# Altium schematic sheet Sheet1.SchDoc
size 304 x 190 mm; SheetNumber: 1; SheetTotal: 2
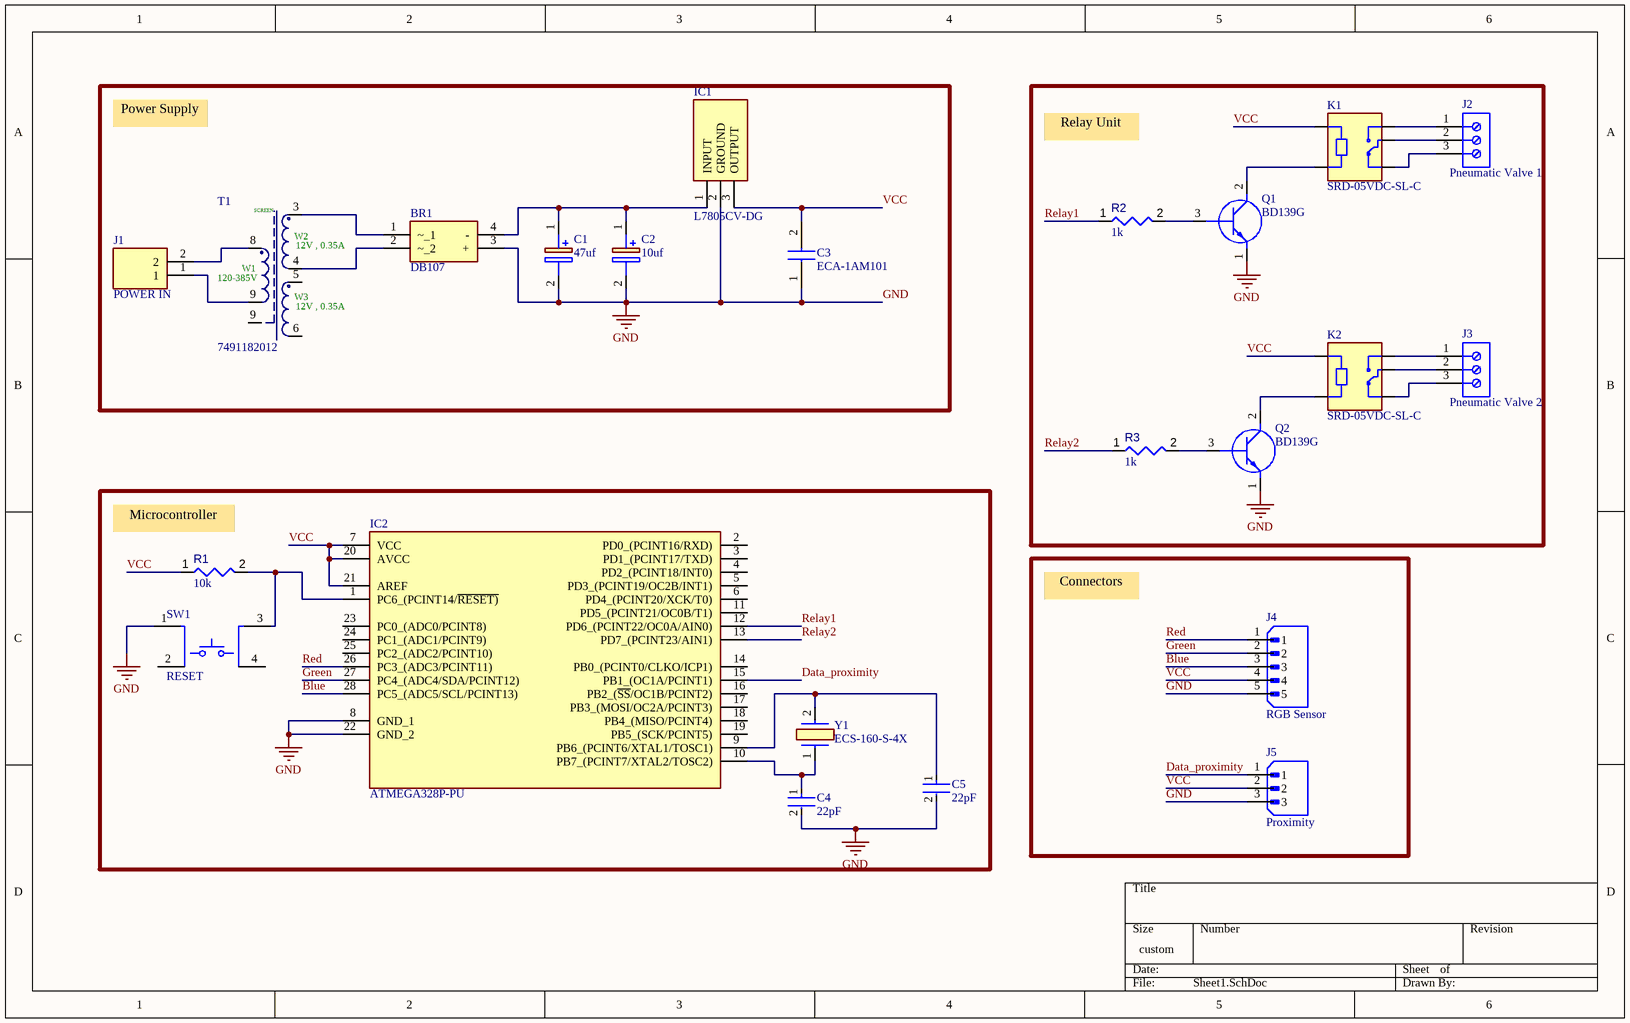
[diagram p0: Sheet1.SchDoc]

## Parts
BR1  DB107  [DIP825W50P510L830H340Q4N]
C1  47uf  [CAPPRD250W55D630H1220]
C2  10uf  [CAPPRD200W55D500H1200]
C3  ECA-1AM101  [CAPPRD200W55D525H1200]
C4  22pF  [FP-RCE0DB-MFG]
C5  22pF  [FP-RCE0DB-MFG]
IC1  L7805CV-DG  [TO255P460X1020X2008-3P]
IC2  ATMEGA328P-PU  [DIP794W53P254L3467H457Q28N]
J1  POWER IN  [TB00250002BE]
J2  Pneumatic Valve 1  [691101710003]
J3  Pneumatic Valve 2  [691101710003]
J4  RGB Sensor  [JST_B5B-XH-A(LF)(SN)]
J5  Proximity  [JST_B3B-XH-A (LF)(SN)]
K1  SRD-05VDC-SL-C  [RELAY_SRD-05VDC-SL-C]
K2  SRD-05VDC-SL-C  [RELAY_SRD-05VDC-SL-C]
Q1  BD139G  [TO229P300X760X1364-3P]
Q2  BD139G  [TO229P300X760X1364-3P]
R1  value 10k  [RESA60-630X240]  (hidden comment: MFR-25FBF52-10K)
R2  value 1k  [RESA60-630X240]  (hidden comment: MFR-25FBF52-1K)
R3  value 1k  [RESA60-630X240]  (hidden comment: MFR-25FBF52-1K)
SW1  RESET  [FP-SKQBARA010-MFG]
T1  7491182012  [EE16_7_4 (E16)]
Y1  ECS-160-S-4X  [ECS160S4X]

## Nets
GND: BR1.3(+) C1.2(-) C2.2(-) C3.1(+) C4.2 C5.2 IC1.2(GROUND) IC2.8(GND_1) IC2.22(GND_2) J4.5 J5.3 Q1.1(E) Q2.1(E) SW1.1
Blue: IC2.28(PC5_(ADC5/SCL/PCINT13)) J4.3
Data_proximity: IC2.15(PB1_(OC1A/PCINT1)) J5.1
Green: IC2.27(PC4_(ADC4/SDA/PCINT12)) J4.2
Red: IC2.26(PC3_(ADC3/PCINT11)) J4.1
Relay1: IC2.12(PD6_(PCINT22/OC0A/AIN0)) R2.1
Relay2: IC2.13(PD7_(PCINT23/AIN1)) R3.1
VCC: C3.2(-) IC1.3(OUTPUT) IC2.7(VCC) IC2.20(AVCC) IC2.21(AREF) J4.4 J5.2 K1.A1 K2.A1 R1.1
NetBR1_1: BR1.1(~_1) T1.3
NetBR1_2: BR1.2(~_2) T1.4
NetBR1_4: BR1.4(-) C1.1(+) C2.1(+) IC1.1(INPUT)
NetC4_1: C4.1 IC2.10(PB7_(PCINT7/XTAL2/TOSC2)) Y1.1
NetC5_1: C5.1 IC2.9(PB6_(PCINT6/XTAL1/TOSC1)) Y1.2
NetIC2_1: IC2.1(PC6_(PCINT14/~{RESET)}) R1.2 SW1.3
NetJ1_1: J1.1 T1.9
NetJ1_2: J1.2 T1.8
NetJ2_1: J2.1 K1.NO
NetJ2_2: J2.2 K1.COM
NetJ2_3: J2.3 K1.NC
NetJ3_1: J3.1 K2.NO
NetJ3_2: J3.2 K2.COM
NetJ3_3: J3.3 K2.NC
NetK1_A2: K1.A2 Q1.2(C)
NetK2_A2: K2.A2 Q2.2(C)
NetQ1_3: Q1.3(B) R2.2
NetQ2_3: Q2.3(B) R3.2

Not connected (* = marked no-connect by the designer): IC2 2(PD0_(PCINT16/RXD)) 3(PD1_(PCINT17/TXD)) 4(PD2_(PCINT18/INT0)) 5(PD3_(PCINT19/OC2B/INT1)) 6(PD4_(PCINT20/XCK/T0)) 11(PD5_(PCINT21/OC0B/T1)) 14(PB0_(PCINT0/CLKO/ICP1)) 16(PB2_(~{SS}/OC1B/PCINT2)) 17(PB3_(MOSI/OC2A/PCINT3)) 18(PB4_(MISO/PCINT4)) 19(PB5_(SCK/PCINT5)) 23(PC0_(ADC0/PCINT8)) 24(PC1_(ADC1/PCINT9)) 25(PC2_(ADC2/PCINT10)); SW1 2 4; T1 5 6

## Notes on the sheet
- Power Supply
- Relay Unit
- (near R1) Microcontroller
- Connectors
- (in symbol CMP-1471-00001-1) SCREEN; W2; 12V , 0.35A; W1; 120-385V; W3

## Library data of the parts
BR1 = DB107: Bridge Rectifier; Manufacturer_Name: Rectron; Datasheet Link: https://www.rectron.com/data_sheets/db101-107.pdf; Height: 3.4mm; Manufacturer_Part_Number: DB107; Mouser Part Number: 583-DB107; Mouser Price/Stock: https://www.mouser.co.uk/ProductDetail/Rectron/DB107?qs=G5AQjGfRJcLGAY%252B6bEDnbw%3D%3D
C1 = ECE-A1EN470UB: Capacitor Polarised; Manufacturer_Name: Panasonic; Datasheet Link: http://industrial.panasonic.com/cdbs/www-data/pdf/RDF0000/ABA0000C1053.pdf; Height: 12.2mm; Manufacturer_Part_Number: ECE-A1EN470UB; Mouser Part Number: 667-ECE-A1EN470UB; Mouser Price/Stock: https://www.mouser.co.uk/ProductDetail/Panasonic/ECE-A1EN470UB?qs=rMMd5vBiahp%252B1Xr0dP1Lmg%3D%3D
C2 = ECA-1EM100: Capacitor Polarised; Manufacturer_Name: Panasonic; Datasheet Link: https://componentsearchengine.com/Datasheets/2/ECA-1EM100.pdf; Height: 12mm; Manufacturer_Part_Number: ECA-1EM100; Mouser Part Number: 667-ECA-1EM100; Mouser Price/Stock: https://www.mouser.com/Search/Refine.aspx?Keyword=667-ECA-1EM100; Arrow Part Number: ECA-1EM100; Arrow Price/Stock: https://www.arrow.com/en/products/eca1em100/panasonic
C3 = ECA-1AM101: Capacitor; Manufacturer_Name: Panasonic; Datasheet Link: http://uk.rs-online.com/web/p/products/8073233; Height: 12mm; Manufacturer_Part_Number: ECA-1AM101; Mouser Part Number: 667-ECA-1AM101; Mouser Price/Stock: https://www.mouser.co.uk/ProductDetail/Panasonic/ECA-1AM101?qs=o8jAzVTWolupLSuBsMrKhQ%3D%3D; Arrow Part Number: ECA-1AM101; Arrow Price/Stock: https://www.arrow.com/en/products/eca-1am101/panasonic?region=nac
C4 C5 = CMP-06035-047347-1: Cap Ceramic 22pF 100V C0G ±5% Radial 2.5mm +125°C Ammo Pack; Lead Diameter: 0.5mm; Lead/Base Style: Straight; Height: 3.5mm; Voltage: 100V; Mount: Through Hole; Min Operating Temperature: -55°C; Height - Seated (Max): 0.138inch; Dielectric: C0G; Width: 0.098inch; Depth: 2.5mm; Lead Pitch: 0.098inch; Packaging: Tape and Reel; Voltage Rating (DC): 100V; Capacitance: 22pF; Package Quantity: 2000; Max Operating Temperature: 125°C; Tolerance: 5%; Termination: Radial; Voltage Rating: 100V; Case/Package: Radial; Resistor Type: Ceramic; Length: 3.6mm; Ratings: AEC-Q200
IC1 = L7805CV-DG: Integrated Circuit; Manufacturer_Name: STMicroelectronics; Datasheet Link: http://www.st.com/web/en/resource/technical/document/datasheet/CD00000444.pdf; Height: 4.6mm; Manufacturer_Part_Number: L7805CV-DG; Mouser Part Number: 511-L7805CV-DG; Mouser Price/Stock: https://www.mouser.co.uk/ProductDetail/STMicroelectronics/L7805CV-DG?qs=T%2FOtf55vL7c3O0as9P9fAw%3D%3D; Arrow Part Number: L7805CV-DG; Arrow Price/Stock: https://www.arrow.com/en/products/l7805cv-dg/stmicroelectronics?region=europe
IC2 = ATMEGA328P-PU: Integrated Circuit; Manufacturer_Name: Microchip; Datasheet Link: https://www.mouser.ca/datasheet/2/268/ATmega48A_PA_88A_PA_168A_PA_328_P_DS_DS40002061B-3050139.pdf; Height: 4.572mm; Manufacturer_Part_Number: ATMEGA328P-PU; Mouser Part Number: 556-ATMEGA328P-PU; Mouser Price/Stock: https://www.mouser.co.uk/ProductDetail/Microchip-Technology/ATMEGA328P-PU?qs=K8BHR703ZXguOQv3sKbWcg%3D%3D; Arrow Part Number: ATMEGA328P-PU; Arrow Price/Stock: https://www.arrow.com/en/products/atmega328p-pu/microchip-technology?region=europe
J1 = TB002-500-02BE: Connector; Manufacturer_Name: CUI Devices; Datasheet Link: https://eu.mouser.com/datasheet/2/670/tb002_500-1550579.pdf; Height: 10.4mm; Manufacturer_Part_Number: TB002-500-02BE; Mouser Part Number: 490-TB002-500-02BE; Mouser Price/Stock: https://www.mouser.co.uk/ProductDetail/CUI-Devices/TB002-500-02BE?qs=vLWxofP3U2x9716kcgva%2Fw%3D%3D; Arrow Part Number: TB002-500-02BE; Arrow Price/Stock: https://www.arrow.com/en/products/tb002-500-02be/cui-devices?region=nac
J2 J3 = CMP-1502-03257-2: NexarPartId: 8917705; Voltage Rating: 250V; Current: 16A; Wire Gauge (Min): 14AWG; Pitch: 5.0038mm; Wire Gauge (Max): 26AWG; Number of Positions Per Level: 3; Plating: Steel; Number of Levels: 1; Stripping Length: -7mm; REACH SVHC: Unknown; Width: 16.2mm; Height: 16.4mm; Contact Material: Brass; RoHS: Compliant; Color: Blue; Contact Plating: Tin; Lead Pitch: 5mm; Packaging: Box; Termination: Screw; Number of Contacts: 3; Wire/Cable Gauge: 26AWG; Min Operating Temperature: -40°C; Max Operating Temperature: 105°C; Housing Material: Nylon; Length: 9mm; Voltage: 250V; Mount: Through Hole; Current Rating: 16A; Number of Pins: 3
J4 = B5B-XH-A(LF)(SN): Connector Header Through Hole 5 position 0.098 (2.50mm); MF: JST Sales America Inc.; SnapEDA_Link: https://www.snapeda.com/parts/B5B-XH-A(LF)(SN)/JST+Sales+America+Inc./view-part/?ref=snap; Package: None; Value: *; MP: B5B-XH-A(LF)(SN); Check_prices: https://www.snapeda.com/parts/B5B-XH-A(LF)(SN)/JST+Sales+America+Inc./view-part/?ref=eda
J5 = B3B-XH-A_(LF)(SN): Connector Header Through Hole 3 position 0.098 (2.50mm); MF: JST Sales America Inc.; MP: B3B-XH-A (LF)(SN); SnapEDA_Link: https://www.snapeda.com/parts/B3B-XH-A%20(LF)(SN)/JST+Sales+America+Inc./view-part/?ref=snap; Package: None; Value: *; Check_prices: https://www.snapeda.com/parts/B3B-XH-A%20(LF)(SN)/JST+Sales+America+Inc./view-part/?ref=eda
K1 K2 = SRD-05VDC-SL-C: 5V Trigger Relay Module For Arduino And Raspberry Pi 5V Trigger Relay Module For Arduino And Raspberry Pi; MF: Songle Relay; Check_prices: https://www.snapeda.com/parts/SRD-05VDC-SL-C/Songle+Relay/view-part/?ref=eda; Value: *; Availability: Not in stock; Price: None; Package: NON STANDARD-5 Songle Relay; MP: SRD-05VDC-SL-C; SnapEDA_Link: https://www.snapeda.com/parts/SRD-05VDC-SL-C/Songle+Relay/view-part/?ref=snap
Q1 Q2 = BD139G: Transistor BJT NPN; Manufacturer_Name: onsemi; Datasheet Link: http://www.onsemi.com/pub/Collateral/BD135-D.PDF; Height: 3mm; Manufacturer_Part_Number: BD139G; Mouser Part Number: 863-BD139G; Mouser Price/Stock: https://www.mouser.co.uk/ProductDetail/onsemi/BD139G?qs=vNc2DXHODiLIqGggNMT6cg%3D%3D; Arrow Part Number: BD139G; Arrow Price/Stock: https://www.arrow.com/en/products/bd139g/on-semiconductor?region=nac
R1 = CMP-009-00047-4: Axial Resistor, 10 KOhm, +/- 1%, 0.25 W, -55 to 155 degC, 2-Pin THD, RoHS, Bulk; Manufacturer: Yageo; Power: 250mW; Voltage Rating: 250V; Manufacturer URL: http://www.yageo.com/; Datasheet URL: http://www.yageo.com/documents/recent/Yageo%20LR_MFR_2013.pdf; Package Reference: MFR-25; Min Operating Temperature: -55°C; Mounting Technology: TH; Package Quantity: 200; Case/Package: Axial; Tolerance: 1%; RoHS Compliant: True; Datasheet Version: Apr-13; Packaging: Bulk; Max Operating Temperature: 155°C; Package Description: 2-Pin Axial Lead, Dia 2.4 mm, Body Length 6.3 mm
R2 R3 = CMP-009-00048-4: Axial Resistor, 1 KOhm, +/- 1%, 250 mW, -55 to 155 degC, 2-Pin THD, RoHS, Bulk; Manufacturer: Yageo; Voltage Rating: 250V; Power: 250mW; Min Operating Temperature: -55°C; Max Operating Temperature: 155°C; Tolerance: 1%; Package Reference: MFR-25; Composition: CarbonFilm; Mounting Technology: TH; Packaging: Bulk; Case/Package: Axial; Datasheet URL: http://www.yageo.com/documents/recent/Yageo%20LR_MFR_2013.pdf; Package Quantity: 200; Manufacturer URL: http://www.yageo.com/; Package Description: 2-Pin Axial Lead, Dia 2.4 mm, Body Length 6.3 mm; Datasheet Version: Apr-13; RoHS Compliant: True
SW1 = CMP-00631-07849992-1: SKQBARA010 Switch Tactile N.O. SPST Round Button PC Pins 0.05A 12VDC 1.57N Thru-Hole Automotive; Life (Cycles): 100kcycles; Max Voltage Rating (DC): 12V; Contact Current Rating: 50mA; Contact Resistance: 500mΩ; Actuator Length: 850µm; Number of Positions: 2; Max Operating Temperature: 90°C; Throw Configuration: SPST; Contact Plating: Silver; Electrical Life: 100kcycles; RoHS: Compliant; Height: 5mm; Voltage Rating (DC): 12V; Termination: PC Pins; Orientation: Straight; Depth: 10.3mm; NexarPartId: 7849992; Packaging: Bulk; Color: Grey; Operating Force: 1.57N; Radiation Hardening: No; Schedule B: 8536509065, 8536509065; Current Rating: 50mA; Lead Free: Lead Free; Length: 10mm; Mount: Through Hole; Max Current Rating: 50mA; Min Operating Temperature: -40°C
T1 = CMP-1471-00001-1: Off-Line Transformer WE-UNIT , L=0.9mH; Manufacturer: Wuerth Elektronik; Turns Ratio: "9.5","1:1"; Inductance: 0.9mH; Output Voltage (DC): 12; Output Current (A): 0.6; Input Voltage (AC): 85-265; ComponentLink1Description: Manufacturer URL; ComponentLink1URL: http://www.we-online.com; PackageReference: EE16_7_4 (E16); ComponentLink2Description: Datasheet; ComponentLink2URL: http://www.we-online.de/katalog/media/pdf/7491182012.pdf; PartNumber: 7491182012
Y1 = ECS-160-S-4X: Crystal or Oscillator; Manufacturer_Name: ECS; Datasheet Link: http://www.ecsxtal.com/store/pdf/hc-49usx.pdf; Height: 3.5mm; Manufacturer_Part_Number: ECS-160-S-4X; Mouser Part Number: 520-HCU1600-SX; Mouser Price/Stock: https://www.mouser.co.uk/ProductDetail/ECS/ECS-160-S-4X?qs=CNVyLAqdhH109We7RtSowA%3D%3D; Arrow Part Number: ECS-160-S-4X; Arrow Price/Stock: https://www.arrow.com/en/products/ecs-160-s-4x/ecs-international?region=nac